# EAGLE design vera-module (EAGLE 7.7.0)

## Sheet 1 of 2
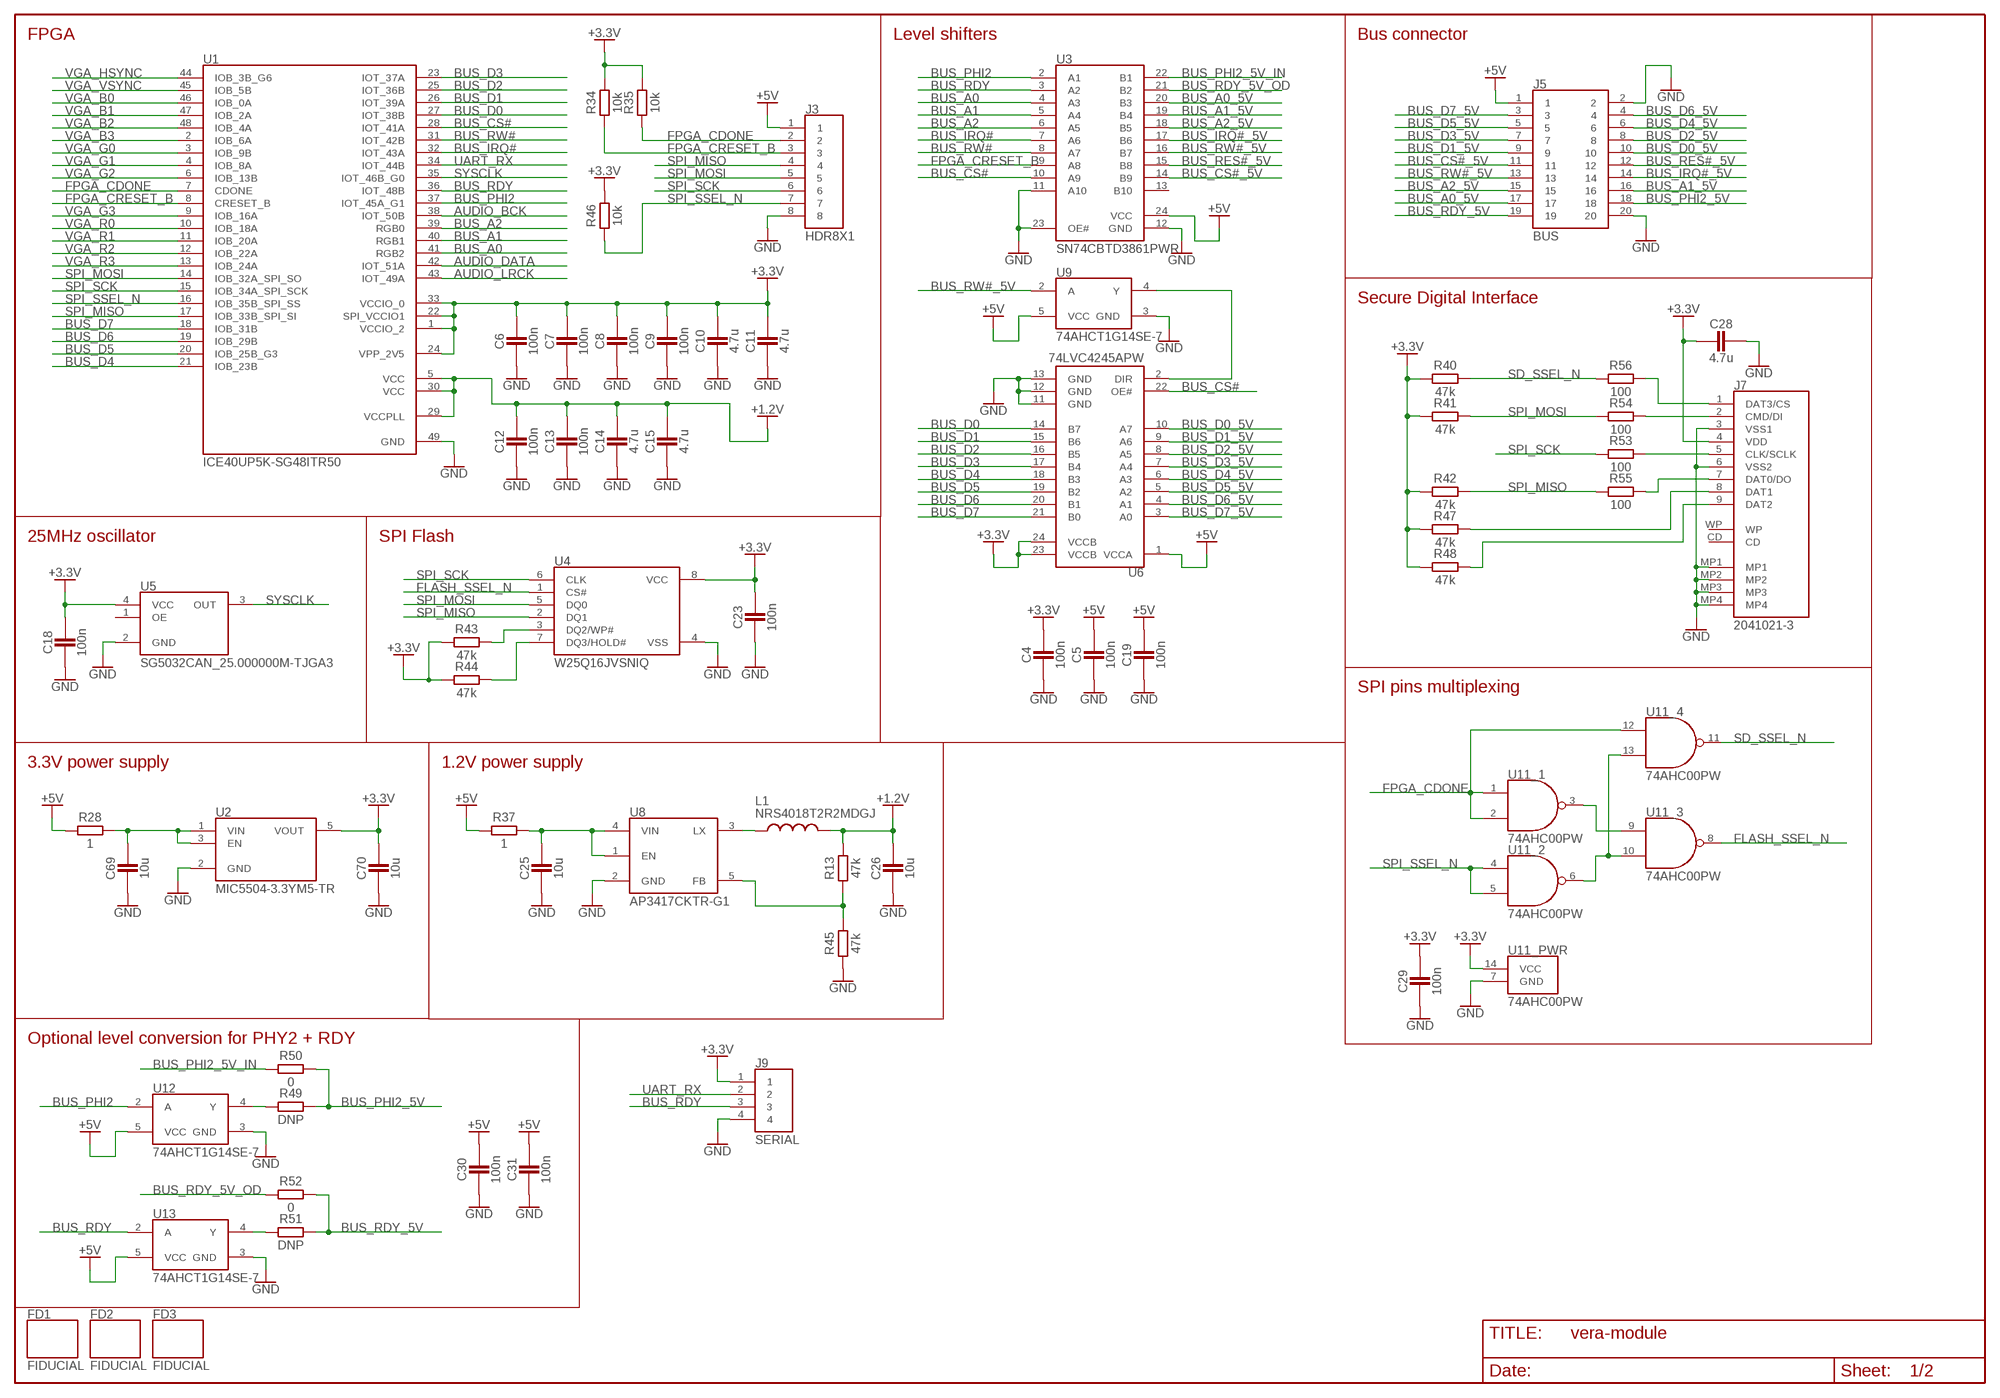
[diagram p0: schematic, sheet 1]

### Parts
C4  100n  CAPACITOR0603  [C0603]
C5  100n  CAPACITOR0603  [C0603]
C6  100n  CAPACITOR0603  [C0603]
C7  100n  CAPACITOR0603  [C0603]
C8  100n  CAPACITOR0603  [C0603]
C9  100n  CAPACITOR0603  [C0603]
C10  4.7u  CAPACITOR0603  [C0603]
C11  4.7u  CAPACITOR0603  [C0603]
C12  100n  CAPACITOR0603  [C0603]
C13  100n  CAPACITOR0603  [C0603]
C14  4.7u  CAPACITOR0603  [C0603]
C15  4.7u  CAPACITOR0603  [C0603]
C18  100n  CAPACITOR0603  [C0603]
C19  100n  CAPACITOR0603  [C0603]
C23  100n  CAPACITOR0603  [C0603]
C25  10u  CAPACITOR0805  [C0805]
C26  10u  CAPACITOR0805  [C0805]
C28  4.7u  CAPACITOR0603  [C0603]
C29  100n  CAPACITOR0603  [C0603]
C30  100n  CAPACITOR0603  [C0603]
C31  100n  CAPACITOR0603  [C0603]
C69  10u  CAPACITOR0805  [C0805]
C70  10u  CAPACITOR0805  [C0805]
FD1  FIDUCIAL  [FIDUCIAL]
FD2  FIDUCIAL  [FIDUCIAL]
FD3  FIDUCIAL  [FIDUCIAL]
J3  HDR8X1  [HDR8X1]
J5  BUS  HDR2X10  [HDR2X10]
J7  2041021-3  [2041021-3]
J9  SERIAL  HDR4X1  [HDR4X1]
L1  NRS4018T2R2MDGJ  INDUCTORNRS4018  [NRS4018]
R13  47k  RESISTOR0603  [R0603]
R28  1  RESISTOR0603  [R0603]
R34  10k  RESISTOR0603  [R0603]
R35  10k  RESISTOR0603  [R0603]
R37  1  RESISTOR0603  [R0603]
R40  47k  RESISTOR0603  [R0603]
R41  47k  RESISTOR0603  [R0603]
R42  47k  RESISTOR0603  [R0603]
R43  47k  RESISTOR0603  [R0603]
R44  47k  RESISTOR0603  [R0603]
R45  47k  RESISTOR0603  [R0603]
R46  10k  RESISTOR0603  [R0603]
R47  47k  RESISTOR0603  [R0603]
R48  47k  RESISTOR0603  [R0603]
R49  DNP  RESISTOR0603  [R0603]
R50  0  RESISTOR0603  [R0603]
R51  DNP  RESISTOR0603  [R0603]
R52  0  RESISTOR0603  [R0603]
R53  100  RESISTOR0603  [R0603]
R54  100  RESISTOR0603  [R0603]
R55  100  RESISTOR0603  [R0603]
R56  100  RESISTOR0603  [R0603]
U1  ICE40UP5K-SG48ITR50  [QFN-48]
U2  MIC5504-3.3YM5-TR  [SOT-23-5]
U3  SN74CBTD3861PWR  [TSSOP-24]
U4  W25Q16JVSNIQ  QSPI_FLASHSOIC8  [SOIC-8]
U5  SG5032CAN_25.000000M-TJGA3  SG5032CAN_40.000000M-TJGA3  [SG5032]
U6  74LVC4245APW  [TSSOP-24]
U8  AP3417CKTR-G1  [SOT-23-5]
U9  74AHCT1G14SE-7  [TSSOP-5]
U11  74AHC00PW  [TSSOP-14]
U12  74AHCT1G14SE-7  [TSSOP-5]
U13  74AHCT1G14SE-7  [TSSOP-5]

### Nets
+1.2V: C12.2 C13.2 C14.2 C15.2 C26.2 L1.2 R13.2 U1.5(VCC) U1.29(VCCPLL) U1.30(VCC)
+3.3V: C4.2 C6.2 C7.2 C8.2 C9.2 C10.2 C11.2 C18.2 C23.2 C28.1 C29.2 C70.2 J7.4(VDD) J9.1 R34.1 R35.1 R40.1 R41.1 R42.1 R43.1 R44.1 R46.1 R47.1 R48.1 U1.1(VCCIO_2) U1.22(SPI_VCCIO1) U1.24(VPP_2V5) U1.33(VCCIO_0) U2.5(VOUT) U4.8(VCC) U5.4(VCC) U6.23(VCCB) U6.24(VCCB) U11.14(_PWR:VCC) ; also sheet 2
+5V [5V]: C5.2 C19.2 C30.2 C31.2 J3.1 J5.1 R28.1 R37.1 U3.24(VCC) U6.1(VCCA) U9.5(VCC) U12.5(VCC) U13.5(VCC)
AUDIO_BCK: U1.38(IOT_50B) ; also sheet 2
AUDIO_DATA: U1.42(IOT_51A) ; also sheet 2
AUDIO_LRCK: U1.43(IOT_49A) ; also sheet 2
BUS_A0: U1.41(RGB2) U3.4(A3)
BUS_A0_5V: J5.17 U3.20(B3)
BUS_A1: U1.40(RGB1) U3.5(A4)
BUS_A1_5V: J5.16 U3.19(B4)
BUS_A2: U1.39(RGB0) U3.6(A5)
BUS_A2_5V: J5.15 U3.18(B5)
BUS_CS#: U1.28(IOT_41A) U3.10(A9) U6.22(OE#)
BUS_CS#_5V: J5.11 U3.14(B9)
BUS_D0: U1.27(IOT_38B) U6.14(B7)
BUS_D0_5V: J5.10 U6.10(A7)
BUS_D1: U1.26(IOT_39A) U6.15(B6)
BUS_D1_5V: J5.9 U6.9(A6)
BUS_D2: U1.25(IOT_36B) U6.16(B5)
BUS_D2_5V: J5.8 U6.8(A5)
BUS_D3: U1.23(IOT_37A) U6.17(B4)
BUS_D3_5V: J5.7 U6.7(A4)
BUS_D4: U1.21(IOB_23B) U6.18(B3)
BUS_D4_5V: J5.6 U6.6(A3)
BUS_D5: U1.20(IOB_25B_G3) U6.19(B2)
BUS_D5_5V: J5.5 U6.5(A2)
BUS_D6: U1.19(IOB_29B) U6.20(B1)
BUS_D6_5V: J5.4 U6.4(A1)
BUS_D7: U1.18(IOB_31B) U6.21(B0)
BUS_D7_5V: J5.3 U6.3(A0)
BUS_IRQ#: U1.32(IOT_43A) U3.7(A6)
BUS_IRQ#_5V: J5.14 U3.17(B6)
BUS_PHI2: U1.37(IOT_45A_G1) U3.2(A1) U12.2(A)
BUS_PHI2_5V: J5.18 R49.2 R50.2
BUS_PHI2_5V_IN: R50.1 U3.22(B1)
BUS_RDY: J9.3 U1.36(IOT_48B) U3.3(A2) U13.2(A)
BUS_RDY_5V: J5.19 R51.2 R52.2
BUS_RDY_5V_OD: R52.1 U3.21(B2)
BUS_RES#_5V: J5.12 U3.15(B8)
BUS_RW#: U1.31(IOT_42B) U3.8(A7)
BUS_RW#_5V: J5.13 U3.16(B7) U9.2(A)
FLASH_SSEL_N: U4.1(CS#) U11.8(_3:Y)
FPGA_CDONE: J3.2 R35.2 U1.7(CDONE) U11.1(_1:A) U11.2(_1:B) U11.12(_4:A)
FPGA_CRESET_B: J3.3 R34.2 U1.8(CRESET_B) U3.9(A8)
GND: C4.1 C5.1 C6.1 C7.1 C8.1 C9.1 C10.1 C11.1 C12.1 C13.1 C14.1 C15.1 C18.1 C19.1 C23.1 C25.1 C26.1 C28.2 C29.1 C30.1 C31.1 C69.1 C70.1 J3.8 J5.2 J5.20 J7.3(VSS1) J7.6(VSS2) J7.MP1 J7.MP2 J7.MP3 J7.MP4 J9.4 R45.1 U1.49(GND) U2.2(GND) U3.11(A10) U3.12(GND) U3.23(OE#) U4.4(VSS) U5.2(GND) U6.11(GND) U6.12(GND) U6.13(GND) U8.2(GND) U9.3(GND) U11.7(_PWR:GND) U12.3(GND) U13.3(GND) ; also sheet 2
N$7: C69.2 R28.2 U2.1(VIN) U2.3(EN)
N$8: U6.2(DIR) U9.4(Y)
N$14: R43.2 U4.3(DQ2/WP#)
N$15: R13.1 R45.2 U8.5(FB)
N$19: R44.2 U4.7(DQ3/HOLD#)
N$20: L1.1 U8.3(LX)
N$22 [5V]: C25.2 R37.2 U8.1(EN) U8.4(VIN)
N$43: J7.8(DAT1) R47.2
N$44: J7.9(DAT2) R48.2
N$46: U11.3(_1:Y) U11.9(_3:A)
N$47: U11.6(_2:Y) U11.10(_3:B) U11.13(_4:B)
N$48: R49.1 U12.4(Y)
N$50: R51.1 U13.4(Y)
N$51: J7.2(CMD/DI) R54.2
N$52: J7.5(CLK/SCLK) R53.2
N$53: J7.1(DAT3/CS) R56.2
N$54: J7.7(DAT0/DO) R55.2
SD_SSEL_N: R40.2 R56.1 U11.11(_4:Y)
SPI_MISO: J3.4 R42.2 R55.1 U1.17(IOB_33B_SPI_SI) U4.2(DQ1)
SPI_MOSI: J3.5 R41.2 R54.1 U1.14(IOB_32A_SPI_SO) U4.5(DQ0)
SPI_SCK: J3.6 R53.1 U1.15(IOB_34A_SPI_SCK) U4.6(CLK)
SPI_SSEL_N: J3.7 R46.2 U1.16(IOB_35B_SPI_SS) U11.4(_2:A) U11.5(_2:B)
SYSCLK: U1.35(IOT_46B_G0) U5.3(OUT) ; also sheet 2
UART_RX: J9.2 U1.34(IOT_44B)
VGA_B0: U1.46(IOB_0A) ; also sheet 2
VGA_B1: U1.47(IOB_2A) ; also sheet 2
VGA_B2: U1.48(IOB_4A) ; also sheet 2
VGA_B3: U1.2(IOB_6A) ; also sheet 2
VGA_G0: U1.3(IOB_9B) ; also sheet 2
VGA_G1: U1.4(IOB_8A) ; also sheet 2
VGA_G2: U1.6(IOB_13B) ; also sheet 2
VGA_G3: U1.9(IOB_16A) ; also sheet 2
VGA_HSYNC: U1.44(IOB_3B_G6) ; also sheet 2
VGA_R0: U1.10(IOB_18A) ; also sheet 2
VGA_R1: U1.11(IOB_20A) ; also sheet 2
VGA_R2: U1.12(IOB_22A) ; also sheet 2
VGA_R3: U1.13(IOB_24A) ; also sheet 2
VGA_VSYNC: U1.45(IOB_5B) ; also sheet 2
Unconnected: J7.CD J7.WP U3.13(B10) U5.1(OE)

### Notes on the sheet
- FPGA | Level shifters | Bus connector
- Secure Digital Interface
- 25MHz oscillator | SPI Flash
- SPI pins multiplexing
- 3.3V power supply | 1.2V power supply
- Optional level conversion for PHY2 + RDY

## Sheet 2 of 2
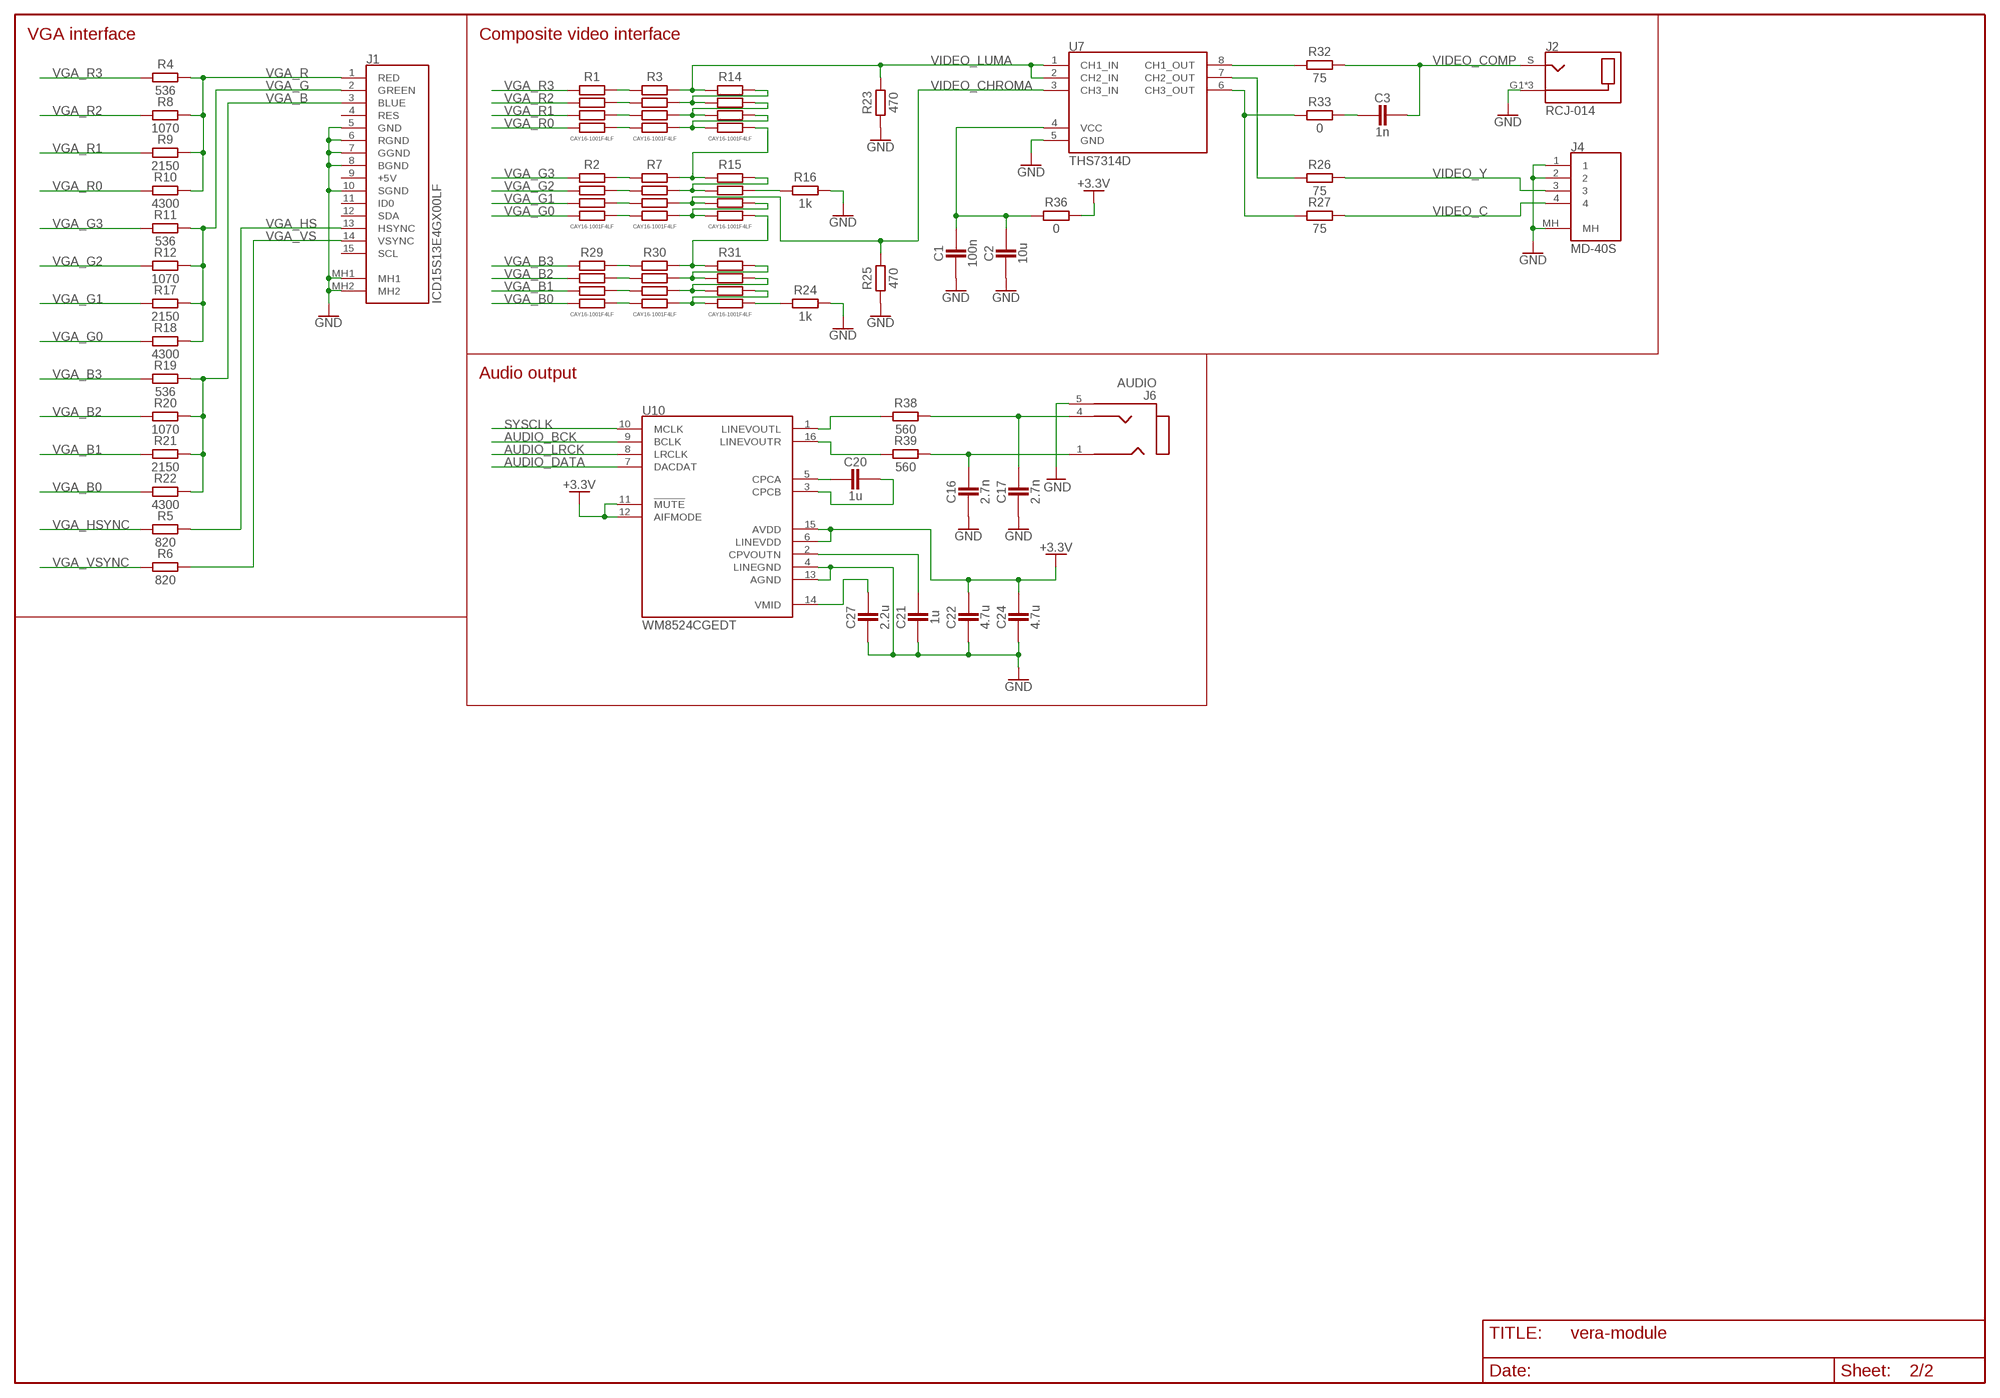
[diagram p1: schematic, sheet 2]

### Parts
C1  100n  CAPACITOR0603  [C0603]
C2  10u  CAPACITOR0805  [C0805]
C3  1n  CAPACITOR0603  [C0603]
C16  2.7n  CAPACITOR0603  [C0603]
C17  2.7n  CAPACITOR0603  [C0603]
C20  1u  CAPACITOR0603  [C0603]
C21  1u  CAPACITOR0603  [C0603]
C22  4.7u  CAPACITOR0603  [C0603]
C24  4.7u  CAPACITOR0603  [C0603]
C27  2.2u  CAPACITOR0603  [C0603]
J1  ICD15S13E4GX00LF  [1-1734344-2]
J2  RCJ-014  [RCJ-01X]
J4  MD-40S  [MD-40S]
J6  AUDIO  35RASMT2BHNTRX  [35RASMT2BHNTRX]
R1  CAY16-1001F4LF  RES_ARRAY41206  [RA4_1206]
R2  CAY16-1001F4LF  RES_ARRAY41206  [RA4_1206]
R3  CAY16-1001F4LF  RES_ARRAY41206  [RA4_1206]
R4  536  RESISTOR0603  [R0603]
R5  820  RESISTOR0603  [R0603]
R6  820  RESISTOR0603  [R0603]
R7  CAY16-1001F4LF  RES_ARRAY41206  [RA4_1206]
R8  1070  RESISTOR0603  [R0603]
R9  2150  RESISTOR0603  [R0603]
R10  4300  RESISTOR0603  [R0603]
R11  536  RESISTOR0603  [R0603]
R12  1070  RESISTOR0603  [R0603]
R14  CAY16-1001F4LF  RES_ARRAY41206  [RA4_1206]
R15  CAY16-1001F4LF  RES_ARRAY41206  [RA4_1206]
R16  1k  RESISTOR0603  [R0603]
R17  2150  RESISTOR0603  [R0603]
R18  4300  RESISTOR0603  [R0603]
R19  536  RESISTOR0603  [R0603]
R20  1070  RESISTOR0603  [R0603]
R21  2150  RESISTOR0603  [R0603]
R22  4300  RESISTOR0603  [R0603]
R23  470  RESISTOR0603  [R0603]
R24  1k  RESISTOR0603  [R0603]
R25  470  RESISTOR0603  [R0603]
R26  75  RESISTOR0603  [R0603]
R27  75  RESISTOR0603  [R0603]
R29  CAY16-1001F4LF  RES_ARRAY41206  [RA4_1206]
R30  CAY16-1001F4LF  RES_ARRAY41206  [RA4_1206]
R31  CAY16-1001F4LF  RES_ARRAY41206  [RA4_1206]
R32  75  RESISTOR0603  [R0603]
R33  0  RESISTOR0603  [R0603]
R36  0  RESISTOR0603  [R0603]
R38  560  RESISTOR0603  [R0603]
R39  560  RESISTOR0603  [R0603]
U7  THS7314D  [SOIC-8]
U10  WM8524CGEDT  [TSSOP-16]

### Nets
+3.3V: C22.2 C24.2 R36.2 U10.6(LINEVDD) U10.11(!MUTE) U10.12(AIFMODE) U10.15(AVDD) ; also sheet 1
AUDIO_BCK: U10.9(BCLK) ; also sheet 1
AUDIO_DATA: U10.7(DACDAT) ; also sheet 1
AUDIO_LRCK: U10.8(LRCLK) ; also sheet 1
GND: C1.1 C2.1 C16.1 C17.1 C21.1 C22.1 C24.1 C27.1 J1.5(GND) J1.6(RGND) J1.7(GGND) J1.8(BGND) J1.10(SGND) J1.MH1 J1.MH2 J2.G1(G) J2.G2(G) J2.G3(G) J4.1 J4.2 J4.MH J6.5(SLEEVE) R16.2 R23.1 R24.2 R25.1 U7.5(GND) U10.4(LINEGND) U10.13(AGND) ; also sheet 1
N$1: R1.1A R3.1B
N$2: R1.2A R3.2B
N$3: R1.3A R3.3B
N$4: R1.4A R3.4B
N$5: R2.1A R7.1B
N$6: R2.2A R7.2B
N$9: R29.1A R30.1B
N$10: R2.3A R7.3B
N$11: R2.4A R7.4B
N$12: R27.1 R33.1 U7.6(CH3_OUT)
N$13: R3.2A R14.1A R14.2B
N$16: R3.3A R14.2A R14.3B
N$17: R3.4A R14.3A R14.4B
N$18: R7.1A R14.4A R15.1B
N$21: R7.2A R15.1A R15.2B
N$23: R32.1 U7.8(CH1_OUT)
N$24: C3.1 R33.2
N$25: R7.4A R15.3A R15.4B
N$26: C20.2 U10.3(CPCB)
N$27: R29.2A R30.2B
N$28: R29.3A R30.3B
N$29: R15.2A R16.1
N$30: R29.4A R30.4B
N$31: R15.4A R30.1A R31.1B
N$32: R30.2A R31.1A R31.2B
N$33: R30.3A R31.2A R31.3B
N$34: R24.1 R31.4A
N$35: R30.4A R31.3A R31.4B
N$36: R26.1 U7.7(CH2_OUT)
N$37: C1.2 C2.2 R36.1 U7.4(VCC)
N$38: C17.2 J6.4(TIP) R38.2
N$39: C16.2 J6.1(RING) R39.2
N$40: R38.1 U10.1(LINEVOUTL)
N$41: R39.1 U10.16(LINEVOUTR)
N$42: C20.1 U10.5(CPCA)
N$45: C21.2 U10.2(CPVOUTN)
N$49: C27.2 U10.14(VMID)
SYSCLK: U10.10(MCLK) ; also sheet 1
VGA_B: J1.3(BLUE) R19.2 R20.2 R21.2 R22.2
VGA_B0: R22.1 R29.4B ; also sheet 1
VGA_B1: R21.1 R29.3B ; also sheet 1
VGA_B2: R20.1 R29.2B ; also sheet 1
VGA_B3: R19.1 R29.1B ; also sheet 1
VGA_G: J1.2(GREEN) R11.2 R12.2 R17.2 R18.2
VGA_G0: R2.4B R18.1 ; also sheet 1
VGA_G1: R2.3B R17.1 ; also sheet 1
VGA_G2: R2.2B R12.1 ; also sheet 1
VGA_G3: R2.1B R11.1 ; also sheet 1
VGA_HS: J1.13(HSYNC) R5.2
VGA_HSYNC: R5.1 ; also sheet 1
VGA_R: J1.1(RED) R4.2 R8.2 R9.2 R10.2
VGA_R0: R1.4B R10.1 ; also sheet 1
VGA_R1: R1.3B R9.1 ; also sheet 1
VGA_R2: R1.2B R8.1 ; also sheet 1
VGA_R3: R1.1B R4.1 ; also sheet 1
VGA_VS: J1.14(VSYNC) R6.2
VGA_VSYNC: R6.1 ; also sheet 1
VIDEO_C: J4.4 R27.2
VIDEO_CHROMA: R7.3A R15.3B R25.2 U7.3(CH3_IN)
VIDEO_COMP: C3.2 J2.S R32.2
VIDEO_LUMA: R3.1A R14.1B R23.2 U7.1(CH1_IN) U7.2(CH2_IN)
VIDEO_Y: J4.3 R26.2
Unconnected: J1.4(RES) J1.9(+5V) J1.11(ID0) J1.12(SDA) J1.15(SCL)

### Notes on the sheet
- VGA interface | Composite video interface
- Audio output

## Library data of the parts
C1-C31 C69 C70 = rcl:CAPACITOR
FD1-FD3 = misc:FIDUCIAL
J1 = connectors:ICD15S13E4GX00LF
J2 = connectors:RCJ-014
J3 = connectors:HDR8X1
J4 = connectors:MD-40S
J5 = connectors:HDR2X10
J6 = connectors:35RASMT2BHNTRX
J7 = connectors:2041021-3
J9 = connectors:HDR4X1
L1 = rcl:INDUCTOR
R1-R3 R7 R14 R15 R29-R31 = rcl:RES_ARRAY4
R4-R6 R8-R13 R16-R28 R32-R56 = rcl:RESISTOR
U1 = integrated_circuits:ICE40UP5K-SG48ITR50: Lattice ICE40 5K LE FPGA
U2 = integrated_circuits:MIC5504-3.3YM5-TR
U3 = integrated_circuits:SN74CBTD3861PWR
U4 = integrated_circuits:QSPI_FLASH
U5 = integrated_circuits:SG5032CAN_40.000000M-TJGA3: Epson 40 MHz 3.3V Oscillator +/- 50ppm
U6 = integrated_circuits:74LVC4245APW
U7 = integrated_circuits:THS7314D
U8 = integrated_circuits:AP3417CKTR-G1
U9 U12 U13 = integrated_circuits:74AHCT1G14SE-7
U10 = integrated_circuits:WM8524CGEDT
U11 = integrated_circuits:74AHC00PW

## Net classes
1 5V: clearance 0.2 mm

## Board
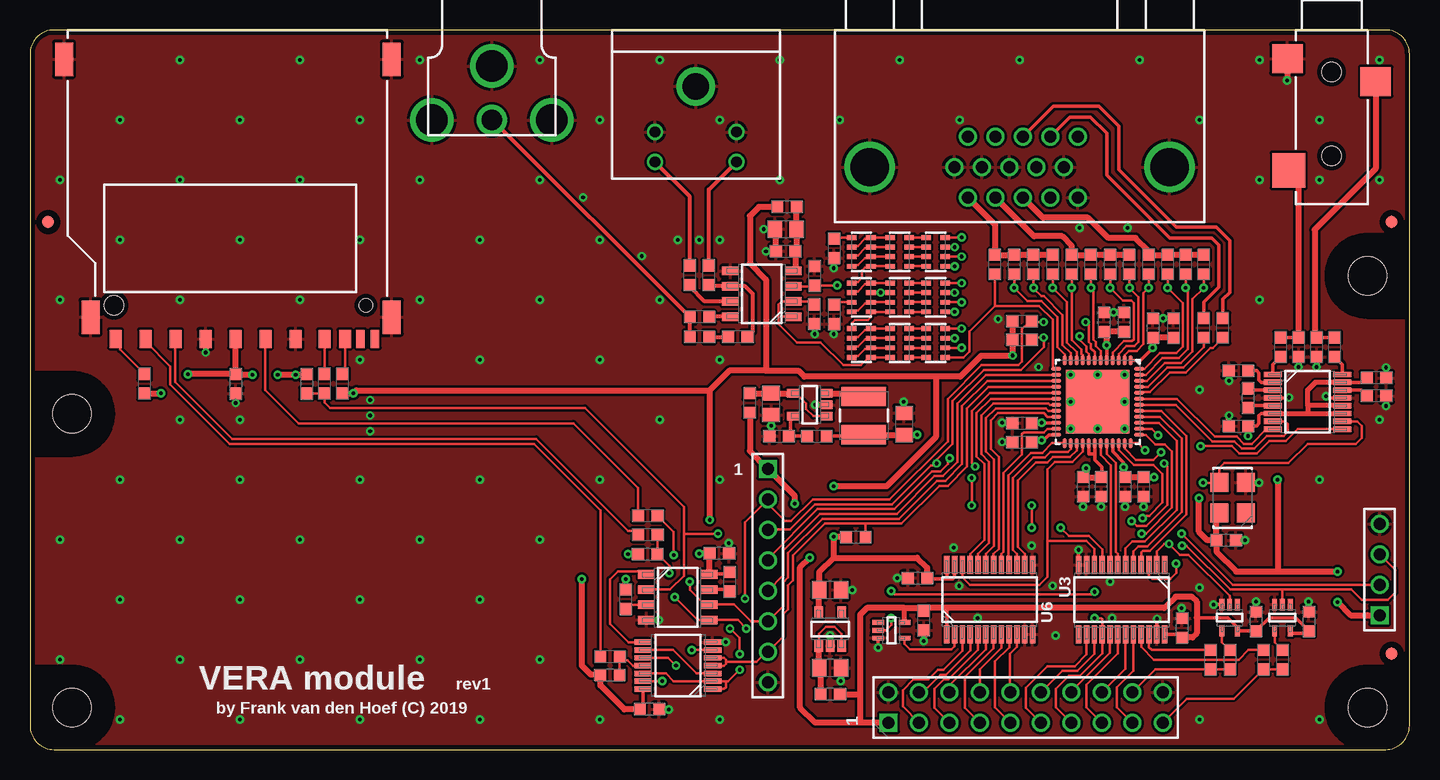
[diagram p2: board, top side]
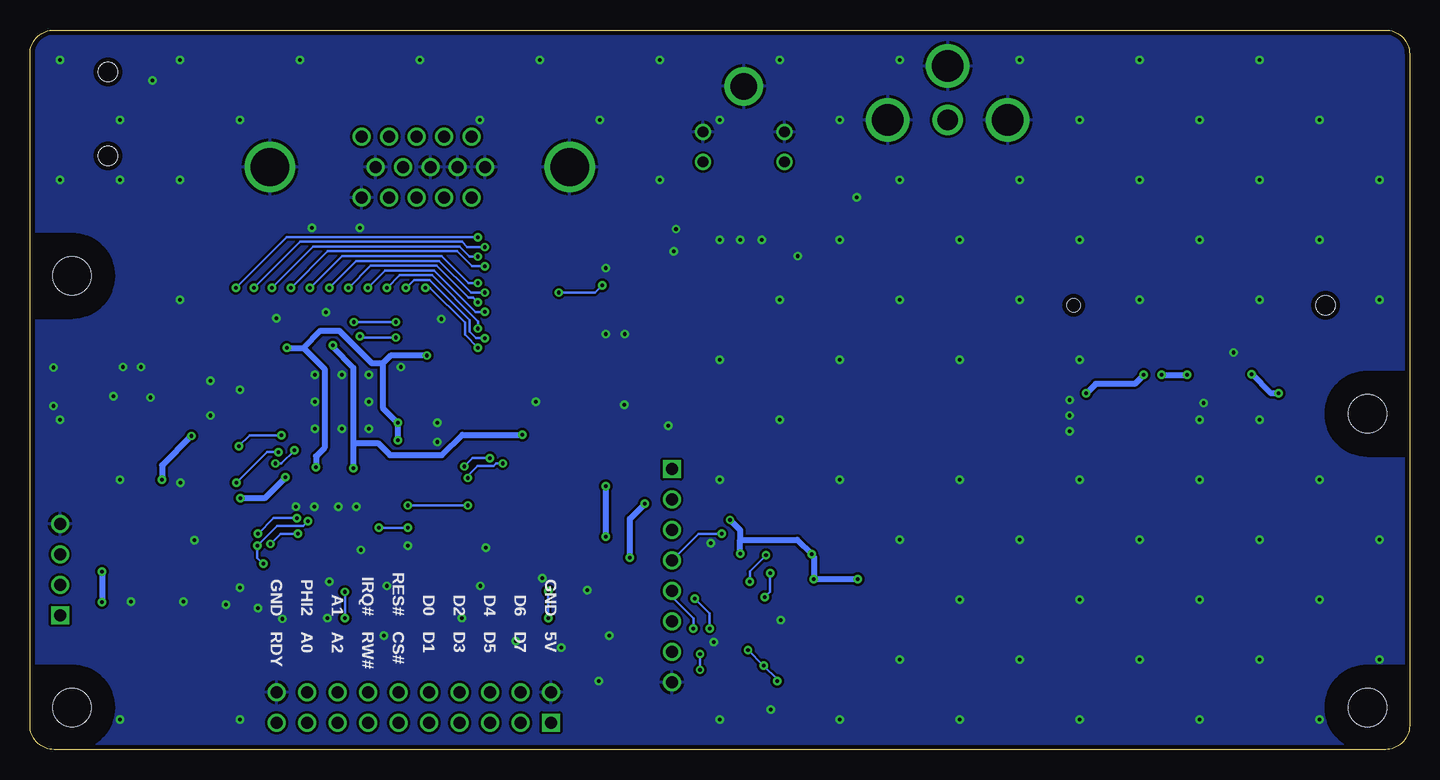
[diagram p3: board, bottom side, seen from below]

Size 115 x 60 mm. Coordinates in mm from the lower left corner, seen from the top.
Outline: 115,2 115,58 arc90 113,60 2,60 arc90 0,58 0,2 arc90 2,0 113,0 arc90 115,2
Copper layers (1*16): Top 0.035mm / dielectric 1.6mm / Bottom 0.035mm
Design rules "Frank_2-layer *": minimum track width 0.2mm, minimum drill 0.3mm, track to track 0.2mm, track to pad 0.2mm, pad to pad 0.2mm, via to via 0.2mm, smd to smd 0mil, copper to edge 0.4mm, drill to drill 10mil, minimum pad ring 0.2mm, minimum via ring 0.2mm, stop-mask expansion 0.1mm, vias tented up to drill 20mil, thermal gap 10mil
Holes 3.2 mm at 3.5,28 3.5,3.5 111.5,3.5 111.5,39.5
tRestrict: area 86,26 to 92,32; area 0,24.5 to 7,31.5; area 0,0 to 7,7; area 108,0 to 115,7; area 108,36 to 115,43
bRestrict: area 0,24.5 to 7,31.5; area 0,0 to 7,7; area 108,0 to 115,7; area 108,36 to 115,43

### Footprints (pad centres in the part's own frame; a part is rotated, then mirrored left to right if it is on the bottom)
C0603 = smd 0.95 x 1: 1 -0.8,0; 2 0.8,0
C0805 = smd 1.15 x 1.45: 1 -0.9,0; 2 0.9,0
FIDUCIAL = smd 1 x 1: FD 0,0
1-1734344-2 = drill 1: 1 4.315,13.97; 2 2.025,13.97; 3 -0.265,13.97; 4 -2.555,13.97; 5 -4.845,13.97; 6 5.455,11.43; 7 3.165,11.43; 8 0.875,11.43; 9 -1.415,11.43; 10 -3.705,11.43; 11 4.315,8.89; 12 2.025,8.89; 13 -0.265,8.89; 14 -2.555,8.89; 15 -4.845,8.89 | drill 3.18: MH1 -12.495,11.43; MH2 12.495,11.43
RCJ-01X = drill 2.6: G1 0,0; G2 -5,-4.5; G3 5,-4.5 | drill 1.7: S 0,-4.5
HDR8X1 = drill 1 square: 1 0,8.89 | drill 1: 2 0,6.35; 3 0,3.81; 4 0,1.27; 5 0,-1.27; 6 0,-3.81; 7 0,-6.35; 8 0,-8.89
MD-40S = drill 0.9: 1 -3.4,-8.5; 2 3.4,-8.5; 3 -3.4,-11; 4 3.4,-11 | drill 2.2: MH 0,-4.7
HDR2X10 = drill 1 square: 1 -1.27,11.43 | drill 1: 2 1.27,11.43; 3 -1.27,8.89; 4 1.27,8.89; 5 -1.27,6.35; 6 1.27,6.35; 7 -1.27,3.81; 8 1.27,3.81; 9 -1.27,1.27; 10 1.27,1.27; 11 -1.27,-1.27; 12 1.27,-1.27; 13 -1.27,-3.81; 14 1.27,-3.81; 15 -1.27,-6.35; 16 1.27,-6.35; 17 -1.27,-8.89; 18 1.27,-8.89; 19 -1.27,-11.43; 20 1.27,-11.43
35RASMT2BHNTRX = smd 2.4 x 2.55: 1 4.3,3.675; 5 2.4,-3.675 | smd 2.9 x 2.75: 4 11.7,-3.575 | hole 1.6: 3.5,0; 10.5,0
2041021-3 = smd 1 x 1.5: 1 6.875,25.75; 2 4.375,25.75; 3 1.875,25.75; 4 -0.625,25.75; 5 -3.125,25.75; 6 -5.625,25.75; 7 -8.055,25.75; 8 -9.755,25.75; 9 9.375,25.75 | smd 0.7 x 1.5: CD -11.055,25.75; WP -12.255,25.75 | smd 1.5 x 2.8: MP1 -13.65,23.95; MP2 11.45,23.95; MP3 -13.65,2.45; MP4 13.65,2.45 | hole 1.1: -11.5,22.95 | hole 1.6: 9.5,22.95
HDR4X1 = drill 1 square: 1 0,3.81 | drill 1: 2 0,1.27; 3 0,-1.27; 4 0,-3.81
NRS4018 = smd 1.6 x 3.7: 1 -1.6,0; 2 1.6,0
RA4_1206 = smd 0.4 x 0.8: 1A -1.2,0.8; 1B -1.2,-0.8; 2A -0.4,0.8; 2B -0.4,-0.8; 3A 0.4,0.8; 3B 0.4,-0.8; 4A 1.2,0.8; 4B 1.2,-0.8
R0603 = smd 0.95 x 1: 1 -0.8,0; 2 0.8,0
QFN-48 = smd 0.85 x 0.3: 1 -3.45,2.75; 2 -3.45,2.25; 3 -3.45,1.75; 4 -3.45,1.25; 5 -3.45,0.75; 6 -3.45,0.25; 7 -3.45,-0.25; 8 -3.45,-0.75; 9 -3.45,-1.25; 10 -3.45,-1.75; 11 -3.45,-2.25; 12 -3.45,-2.75; 25 3.45,-2.75; 26 3.45,-2.25; 27 3.45,-1.75; 28 3.45,-1.25; 29 3.45,-0.75; 30 3.45,-0.25; 31 3.45,0.25; 32 3.45,0.75; 33 3.45,1.25; 34 3.45,1.75; 35 3.45,2.25; 36 3.45,2.75 | smd 0.3 x 0.85: 13 -2.75,-3.45; 14 -2.25,-3.45; 15 -1.75,-3.45; 16 -1.25,-3.45; 17 -0.75,-3.45; 18 -0.25,-3.45; 19 0.25,-3.45; 20 0.75,-3.45; 21 1.25,-3.45; 22 1.75,-3.45; 23 2.25,-3.45; 24 2.75,-3.45; 37 2.75,3.45; 38 2.25,3.45; 39 1.75,3.45; 40 1.25,3.45; 41 0.75,3.45; 42 0.25,3.45; 43 -0.25,3.45; 44 -0.75,3.45; 45 -1.25,3.45; 46 -1.75,3.45; 47 -2.25,3.45; 48 -2.75,3.45 | smd 5.3 x 5.3: 49 0,0
SOT-23-5 = smd 1 x 0.71: 1 -1.4,0.95; 2 -1.4,0; 3 -1.4,-0.95; 4 1.4,-0.95; 5 1.4,0.95
TSSOP-24 = smd 1.5 x 0.45: 1 -2.9,3.575; 2 -2.9,2.925; 3 -2.9,2.275; 4 -2.9,1.625; 5 -2.9,0.975; 6 -2.9,0.325; 7 -2.9,-0.325; 8 -2.9,-0.975; 9 -2.9,-1.625; 10 -2.9,-2.275; 11 -2.9,-2.925; 12 -2.9,-3.575; 13 2.9,-3.575; 14 2.9,-2.925; 15 2.9,-2.275; 16 2.9,-1.625; 17 2.9,-0.975; 18 2.9,-0.325; 19 2.9,0.325; 20 2.9,0.975; 21 2.9,1.625; 22 2.9,2.275; 23 2.9,2.925; 24 2.9,3.575
SOIC-8 = smd 1.35 x 0.71: 1 -2.625,1.905; 2 -2.625,0.635; 3 -2.625,-0.635; 4 -2.625,-1.905; 5 2.625,-1.905; 6 2.625,-0.635; 7 2.625,0.635; 8 2.625,1.905
SG5032 = smd 1.6 x 1.5: 1 -1.27,-1.1; 2 1.27,-1.1; 3 1.27,1.1; 4 -1.27,1.1
TSSOP-5 = smd 0.95 x 0.4: 1 -1.1,0.65; 2 -1.1,0; 3 -1.1,-0.65; 4 1.1,-0.65; 5 1.1,0.65
TSSOP-16 = smd 1.5 x 0.45: 1 -2.9,2.275; 2 -2.9,1.625; 3 -2.9,0.975; 4 -2.9,0.325; 5 -2.9,-0.325; 6 -2.9,-0.975; 7 -2.9,-1.625; 8 -2.9,-2.275; 9 2.9,-2.275; 10 2.9,-1.625; 11 2.9,-0.975; 12 2.9,-0.325; 13 2.9,0.325; 14 2.9,0.975; 15 2.9,1.625; 16 2.9,2.275
TSSOP-14 = smd 1.45 x 0.45: 1 -2.9,1.95; 2 -2.9,1.3; 3 -2.9,0.65; 4 -2.9,0; 5 -2.9,-0.65; 6 -2.9,-1.3; 7 -2.9,-1.95; 8 2.9,-1.95; 9 2.9,-1.3; 10 2.9,-0.65; 11 2.9,0; 12 2.9,0.65; 13 2.9,1.3; 14 2.9,1.95

### Placement (x,y rotation side)
C1  63,41.55 0 top
C2  63,43.4 0 top
C3  55.8,34.4 180 top
C4  74,14.3 0 top
C5  96,10.15 270 top
C6  93.6,35.15 270 top
C7  82.7,27.25 0 top
C8  82.7,25.65 0 top
C9  91.3,21.9 90 top
C10  92.85,21.9 90 top
C11  95.3,35.15 270 top
C12  89.5,35.65 270 top
C13  89.3,21.9 90 top
C14  87.8,21.9 90 top
C15  91.2,35.65 270 top
C16  107.25,33.55 90 top
C17  105.75,33.55 90 top
C18  99.7,17.45 180 top
C19  74.5,10.75 90 top
C20  101.55,29.3 90 top
C21  100.75,31.6 0 top
C22  100.75,27 0 top
C23  57.45,16.35 180 top
C24  112.25,31 180 top
C25  61.8,28.8 90 top
C26  72.85,27.15 270 top
C27  112.25,29.5 180 top
C28  17.15,30.5 270 top
C29  51.65,3.35 180 top
C30  102.2,10.7 270 top
C31  106.6,10.7 270 top
C69  66.7,6.8 180 top
C70  66.7,13.3 180 top
FD1  1.5,44 0 top
FD2  113.5,8 0 top
FD3  113.5,44 0 top
J1  82.5,60 180 top
J2  38.5,57 0 top
J3  61.5,14.5 0 top
J4  55.5,60 0 top
J5  83,3.5 90 top
J6  108.5,60 270 top
J7  16.5,60 180 top
J9  112.5,15 180 top
L1  69.5,27.85 270 top
R1  75.5,33.9 90 top
R2  75.5,37.7 90 top
R3  72.5,33.9 90 top
R4  80.45,40.45 90 top
R5  99.45,35.15 90 top
R6  97.85,35.15 90 top
R7  72.5,37.7 90 top
R8  82.05,40.45 90 top
R9  83.65,40.45 90 top
R10  85.25,40.45 90 top
R11  86.85,40.45 90 top
R12  88.45,40.45 90 top
R13  65.6,26.15 0 top
R14  69.3,33.9 90 top
R15  69.3,37.7 90 top
R16  67,36.3 270 top
R17  90.05,40.45 90 top
R18  91.65,40.45 90 top
R19  93.25,40.45 90 top
R20  94.85,40.45 90 top
R21  96.35,40.45 90 top
R22  97.85,40.45 90 top
R23  65.4,36.3 90 top
R24  67,41.8 270 top
R25  65.4,39.5 270 top
R26  55,39.55 90 top
R27  56.6,39.55 90 top
R28  66.7,4.6 180 top
R29  75.5,41.5 90 top
R30  72.5,41.5 90 top
R31  69.3,41.5 90 top
R32  55.8,36.05 180 top
R33  59,34.4 180 top
R34  82.7,34.2 0 top
R35  82.7,35.75 0 top
R36  63.1,45.25 180 top
R37  60,28.9 90 top
R38  104.25,33.55 90 top
R39  108.75,33.55 90 top
R40  48.35,6.25 0 top
R41  51.5,16.3 0 top
R42  23.05,30.5 270 top
R43  49.65,12.55 270 top
R44  58.3,14 270 top
R45  62.45,26.15 0 top
R46  68.85,17.75 0 top
R47  26.05,30.5 90 top
R48  9.55,30.5 90 top
R49  100,7.5 270 top
R50  98.4,7.5 270 top
R51  104.4,7.5 270 top
R52  102.8,7.5 270 top
R53  51.5,19.5 180 top
R54  51.5,17.9 180 top
R55  24.55,30.5 90 top
R56  48.35,7.75 180 top
U1  89,29 270 top
U2  66.7,10.05 90 top
U3  91,12.5 270 top
U4  54,12.7 0 top
U5  100.25,21 90 top
U6  80,12.5 90 top
U7  61,38 180 top
U8  65,28.75 180 top
U9  71.8,9.95 0 top
U10  106.5,29 0 top
U11  54,7 180 top
U12  100,11 270 top
U13  104.4,11 270 top

### Tracks (layer width: path | path; a pad name or v marks a point on that pad's centre or on a via)
+1.2V  (via drill 0.3)
  Top 0.3: U1.5 v89.75,33.7 | U1.30 88.75,24.65 | 88.75,24.65 88.75,24.15 89.35,23.55 89.35,22.75 | R13.2 67.95,26.15 | U1.29 88.25,24.65 88.75,24.65
  Top 0.5: v89.75,33.7 89.75,34.6 C12.2 C15.2 | 89.35,22.75 C13.2 C14.2 88.05,22.95 v88.05,23.45 | 67.95,26.15 68.05,26.25 L1.2 C26.2 v73.95,26.25
  Bottom 0.5: v89.75,33.7 89.75,33.55 88.05,31.85 88.05,25.55 | 88.05,25.55 v88.05,23.45 | 88.05,25.55 86,25.55 85,24.55 80.65,24.55 78.95,26.25 v73.95,26.25
+3.3V  (via drill 0.3)
  Top 0.3: U1.22 v84.35,27.25 | U1.24 84.95,26.25 84.5,25.8 v84.35,25.8 | U1.33 90.25,24.85 91.15,23.95 v91.15,23.55 | U1.1 92.55,32.45 v93.6,33.5 | 56.65,14.63 58.13,14.63 R44.1 | U6.23 77.08,14.38 76.95,14.25 76.35,14.25 | U6.24 76.42,14.32 76.35,14.25 | 76.35,14.25 74.85,14.25 C4.2 | U10.6 102.62,28.02 102.45,27.85 102.45,27.2 102.25,27 C22.2 | U10.15 111.08,30.62 C24.2 | C29.2 51.1,3.6 U11.14
  Top 0.4: U10.15 107.12,30.62 106.5,30 106.5,28.7 | U10.6 106.5,28.02 | 106.5,28.02 U10.11 | U10.12 106.53,28.68 106.5,28.7 | 106.5,28.7 106.5,28.02
  Top 0.5: C7.2 v84.35,27.25 | C8.2 83.65,25.8 v84.35,25.8 | v91.15,23.55 91.15,22.85 C9.2 C10.2 v93.7,22.7 | C11.2 C6.2 v93.6,33.5 | U4.8 56.65,14.63 C23.2 v55.8,16.35 | 99.13,19.75 U5.4 98.9,19.48 C18.2 | R35.1 R34.1 v81.9,32.85 79.3,32.85 77.55,31.1 75.5,31.1 | U2.5 65.75,13.25 C70.2 65.8,14.8 67,16 | C18.2 98.15,17.45 97.45,18.15 v97.45,20.95 | C22.2 v101.55,26.15 | C28.1 17.15,34.23 J7.4 | C28.1 v13.15,31.3 | R48.1 v10.9,29.7 | R47.1 v26.95,29.7 27.2,29.95 56.65,29.95 | R42.1 23,31.25 v22.15,31.25 v20.65,31.25 | v18.55,31.25 17.2,31.25 C28.1 | R41.1 v49.85,16.3 | R43.1 v49.65,14.2 | C29.2 49.55,3.35 47.55,5.35 R40.1 46.75,6.25 46,7 v46,14.2 | 67,16 73.95,16 74.8,15.15 C4.2 | 67,16 v67,17.75 R46.1 | 75.5,31.1 64.55,31.1 64.05,31.6 61.35,31.6 | 75.5,31.1 75.5,26.05 71.4,21.95 v67,21.95 | R36.2 60.75,45.25 60,44.5 60,40.55 61.35,39.2 61.35,31.6 | 61.35,31.6 58.3,31.6 56.65,29.95 | 56.65,29.95 v56.65,19.15 | C18.2 98.9,16.5 100.55,14.85 104,14.85 | 104,14.85 v109,14.85 | v109,12.3 110.1,11.2 111.5,11.2 111.51,11.19 J9.1 | v104,22.5 104,14.85
  Bottom 0.5: v84.35,25.8 v84.35,27.25 85.6,28.5 85.6,32.2 | v93.6,33.5 92.2,33.5 | 92.2,33.5 90.45,31.75 90.45,25.15 91.15,24.45 v91.15,23.55 | v81.9,32.85 84.95,32.85 85.6,32.2 | 85.6,32.2 86.5,32.2 89.2,34.9 90.8,34.9 92.2,33.5 | v93.7,22.7 95.45,20.95 v97.45,20.95 | v10.9,29.7 11.55,29.7 v13.15,31.3 | v22.15,31.25 22.9,30.5 26.15,30.5 v26.95,29.7 | v20.65,31.25 v18.55,31.25 | v56.65,19.15 55.8,18.3 55.8,17.5 | v55.8,16.35 55.8,17.5 | 55.8,17.5 51.05,17.5 v49.85,16.3 49.65,16.1 v49.65,14.2 v46,14.2 | v67,17.75 v67,21.95 | v109,14.85 v109,12.3 | v101.55,26.15 104,23.7 v104,22.5
+5V  (via drill 0.3)
  Top 0.3: U3.24 95.75,9.6 C5.2 | U6.1 76.42,11.68 76.55,11.8 | U13.5 105.05,9.7 106.4,9.7 C31.2 105.5,11 103.3,11 C30.2 U12.5 100.65,10.2 99.85,11 97.25,11
  Top 0.4: U9.5 72.9,11.8
  Top 0.5: C5.2 96.9,9.35 97.25,9.7 97.25,11 97.25,12.35 96.85,12.75 95.5,12.75 94.55,11.8 76.55,11.8 74.75,11.8 C19.2 74.25,11.8 72.9,11.8 69.75,11.8 69.2,11.25 69.2,4.6 | R37.1 60,24.9 61.45,23.45 61.45,23.44 J3.1 63.75,21.14 v63.75,20.5 | R28.1 69.2,4.6 | J5.1 69.2,2.23 | 69.2,2.23 65.47,2.23 64.2,3.5 64.2,15.2 v65,16 | 69.2,4.6 69.2,2.23
  Bottom 0.5: v65,16 65,19.25 v63.75,20.5
AUDIO_BCK  (via drill 0.3)
  Top 0.2: U10.9 105.67,26.73 104.7,25.75 103.3,25.75 102.25,24.7 100.8,24.7 100.2,25.3 v97.6,25.3 | U1.38 93.5,26.75 v94.05,26.2
  Bottom 0.2: v94.05,26.2 96.7,26.2 v97.6,25.3
AUDIO_DATA
  Top 0.2: U10.7 104.62,27.38 104.85,27.15 104.85,26.5 104.5,26.15 103.1,26.15 102.05,25.1 101,25.1 100.4,25.7 98.55,25.7 95.5,28.75 U1.42
AUDIO_LRCK
  Top 0.2: U10.8 103.08,26.73 101.85,25.5 101.2,25.5 100.6,26.1 98.75,26.1 95.6,29.25 U1.43
BUS_A0
  Top 0.2: U1.41 94.3,28.25 96.4,26.15 96.4,19.6 93.35,16.55 92.75,16.55 92.62,16.43 U3.4
BUS_A0_5V
  Top 0.2: U3.20 91.97,6.58 90.6,5.2 90.6,3.52 J5.17
BUS_A1
  Top 0.2: U1.40 94.2,27.75 96,25.95 96,19.8 93.15,16.95 92.4,16.95 91.97,16.52 U3.5
BUS_A1_5V
  Top 0.2: U3.19 91.33,6.75 J5.16
BUS_A2
  Top 0.2: U1.39 94.1,27.25 95.6,25.75 95.6,20 92.95,17.35 91.9,17.35 91.33,16.77 U3.6
BUS_A2_5V
  Top 0.2: U3.18 90.67,8.03 88.05,5.4 88.05,3.53 J5.15
BUS_CS#
  Top 0.2: U1.28 87.75,24.85 86.9,24 85.45,24 84.8,23.35 84.8,17.4 | 84.8,17.4 88.05,17.4 88.72,16.73 U3.10 | U6.22 77.72,14.38 78.35,13.75 84.15,13.75 84.8,14.4 84.8,17.4
BUS_CS#_5V
  Top 0.2: J5.11 83,3.5 83,5.15 84.8,6.95 87.1,6.95 88.08,7.92 U3.14
BUS_D0
  Top 0.2: U1.27 87.25,24.95 86.7,24.4 85.25,24.4 84.8,23.95 83.85,23.95 82.35,22.45 82.35,16.9 82.92,16.32 U6.14
BUS_D0_5V
  Top 0.2: U6.10 82.28,8.57 81.7,8 81.7,4.8 J5.10
BUS_D1
  Top 0.2: U1.26 86.75,25.05 86.5,24.8 85.05,24.8 84.6,24.35 83.64,24.35 81.95,22.66 81.95,16.65 82.28,16.32 U6.15
BUS_D1_5V
  Top 0.2: J5.9 80.45,3.51 80.45,7.35 81.62,8.53 U6.9
BUS_D2
  Top 0.2: U1.25 85.2,25.55 84.4,24.75 83.45,24.75 81.55,22.85 81.55,15.47 U6.16
BUS_D2_5V
  Top 0.2: U6.8 80.97,8.47 79.2,6.7 J5.8
BUS_D3
  Top 0.2: U1.23 84.8,26.75 84.5,26.45 82.85,26.45 82.7,26.3 82.7,24.6 81.15,23.05 81.15,16.5 80.97,16.32 U6.17
BUS_D3_5V
  Top 0.2: U6.7 80.33,8.43 77.95,6.05 77.95,3.47 J5.7 79.19,2.06
BUS_D4
  Top 0.2: U1.21 84.8,27.75 84.5,28.05 80.7,28.05 80.1,27.45 80.1,25.05 80.75,24.4 80.75,16.75 80.33,16.32 U6.18
BUS_D4_5V
  Top 0.2: J5.6 76.65,5.35 79.67,8.38 U6.6
BUS_D5
  Top 0.2: U1.20 84.9,28.25 84.7,28.45 80.5,28.45 79.7,27.65 79.7,24.85 80.35,24.2 80.35,17 79.67,16.32 U6.19
BUS_D5_5V
  Top 0.2: J5.5 75.4,3.48 75.4,5.05 76.2,5.85 76.55,5.85 79.03,8.32 U6.5
BUS_D6
  Top 0.2: U1.19 85,28.75 84.9,28.85 80.3,28.85 79.3,27.85 79.3,24.65 79.95,24 79.95,17.25 79.03,16.32 U6.20
BUS_D6_5V
  Top 0.2: J5.4 74.42,4.77 75.9,6.25 76.35,6.25 78.38,8.28 U6.4
BUS_D7
  Top 0.2: U1.18 80.1,29.25 78.9,28.05 78.9,24.45 79.55,23.8 79.55,17.5 78.38,16.32 U6.21
BUS_D7_5V
  Top 0.2: J5.3 72.75,3.59 72.75,4.95 73.65,5.85 74.9,5.85 75.7,6.65 76.15,6.65 77.72,8.22 U6.3
BUS_IRQ#
  Top 0.2: U1.32 89.75,24.65 90.5,23.9 90.5,16.5 90.67,16.32 U3.7
BUS_IRQ#_5V
  Top 0.2: U3.17 90.03,8.07 86.81,4.86 J5.14
BUS_PHI2  (via drill 0.3)
  Top 0.2: U1.37 93,26.25 93.8,25.45 94.6,25.45 95.2,24.85 95.2,20.2 93,18 v92.65,18 | U3.2 93.92,16.52 94.55,17.15 v94.95,17.15 95.85,16.25 96.55,16.25 100,12.8 U12.2
  Bottom 0.2: v92.65,18 94.1,18 v94.95,17.15
BUS_PHI2_5V
  Top 0.2: R49.2 R50.2 93.82,6.7 J5.18
BUS_PHI2_5V_IN
  Top 0.2: R50.1 93.5,8.3 93.28,8.53 U3.22
BUS_RDY  (via drill 0.3)
  Top 0.2: U1.36 92.35,25.55 v92.95,24.95 | v94.55,23.85 94.8,23.6 94.8,20.4 93.05,18.65 92.25,18.65 v91.85,19.05 | v96.05,17 96.4,17 100.05,13.35 104.4,13.35 | 104.4,13.35 110.15,13.35 111,12.5 113.2,12.5 113.8,13.1 113.8,14.97 J9.3 | U3.3 93.28,14.53 93.55,14.25 95.05,14.25 95.55,14.75 v95.55,15.5 | U13.2 104.4,13.35
  Bottom 0.2: v92.95,24.95 94.05,23.85 v94.55,23.85 | v91.85,19.05 92.25,18.65 94.4,18.65 v96.05,17 96.05,16 v95.55,15.5
BUS_RDY_5V
  Top 0.2: R51.2 R52.2 100.35,4.25 96.45,4.25 J5.19
BUS_RDY_5V_OD
  Top 0.2: R52.1 101.55,8.3 100.75,7.5 93.7,7.5 92.62,8.57 U3.21
BUS_RES#_5V
  Top 0.2: U3.15 88.72,7.97 87.3,6.55 86.05,6.55 J5.12
BUS_RW#
  Top 0.2: U1.31 89.25,24.55 90.1,23.7 90.1,16.05 90.05,16 90.05,15.43 U3.8
BUS_RW#_5V  (via drill 0.3)
  Top 0.2: U9.2 71.35,9.95 71.8,10.4 v71.8,10.95 | v71.8,13.2 72.05,12.95 88.55,12.95 v88.75,13.15 | v88.75,10.95 89.3,10.95 89.38,10.88 U3.16 89.38,8.03 87.5,6.15 86.6,6.15 85.5,5.05 85.5,3.54 J5.13
  Bottom 0.2: v88.75,10.95 v88.75,13.15 | v71.8,10.95 v71.8,13.2
FLASH_SSEL_N
  Top 0.2: 51.35,14.63 U4.1 51.35,14.6 51.1,14.85 49,14.85 48.35,14.2 48.35,10.5 49.9,8.95 U11.8
FPGA_CDONE  (via drill 0.3)
  Top 0.2: U1.7 88.75,33.15 88.45,33.45 88.45,33.8 88.25,34 88.25,35.4 v88,35.65 | v84.5,35.65 83.6,35.65 R35.2 83.4,35.75 82.7,35.05 82.7,32.35 82.4,32.05 79.3,32.05 76.5,29.25 76.5,25.7 71.65,20.85 65.25,20.85 63.45,19.05 62.95,19.05 61.5,20.5 J3.2 59.6,18.95 v59.6,12.6 | U11.1 57.85,5.05 58,5.2 58,5.7 | 58,5.7 58.2,5.7 v59.15,6.65 | 58,5.7 U11.2 53.65,5.7 53,6.35 U11.12 | v58.35,10.1 59.15,9.3 v59.15,7.95
  Bottom 0.2: v88,35.65 v84.5,35.65 | v59.6,12.6 58.35,11.35 v58.35,10.1 | v59.15,7.95 v59.15,6.65
FPGA_CRESET_B  (via drill 0.3)
  Top 0.2: U1.8 88.25,33 88.05,33.2 88.05,33.6 87.5,34.15 v87.5,34.45 | R34.2 83.65,34.35 v84.5,34.35 84.5,33.55 82.6,31.65 79.5,31.65 76.9,29.05 76.9,25.5 75.6,24.2 v75.6,23.85 75.45,23.7 75.1,23.7 71.85,20.45 65.45,20.45 63.35,18.35 61.5,18.35 J3.3 | U3.9 89.38,16.68 88.25,17.8 86.6,17.8 v85.9,18.5 | v83.5,18.5 v83.5,20.35 | v78.5,22.65 v78.5,20.35
  Bottom 0.2: v87.5,34.45 87.4,34.35 v84.5,34.35 | v85.9,18.5 v83.5,18.5 | v83.5,20.35 v78.5,20.35 | v75.6,23.85 76.15,23.85 76.35,23.65 77.7,23.65 78.5,22.85 v78.5,22.65
GND  (via drill 0.3)
  Top 0.2: U3.12 87.4,15.43
  Top 0.3: U3.23 93.92,10.88 v93.95,10.9 | 87.4,15.43 v87.4,16.65 | U9.3 v70.7,8.5 | U10.4 104.92,29.32 v104.95,29.35 | U10.13 108.17,29.32 v108.05,29.45 | U11.7 v58,8.95 | U12.3 v98.65,12.1
  Top 0.5: C70.1 v68.55,13.3 | U8.2 v65.45,28.75 | C25.1 v61.8,27 61.8,26.3 R45.1 | C26.1 v72.85,29 | C7.1 v81.05,27.25 | C8.1 v81.05,25.65 | C13.1 v89.3,20.25 | C9.1 v91.3,20.25 | C10.1 v92.85,20.25 | C11.1 v94.45,35.95 C6.1 | C14.1 v87.8,20.25 | C23.1 v58.25,17.2 | U4.4 v52.4,10.8 | v86.75,31.25 v89,31.25 | v89,31.25 v91.25,31.25 v91.25,29 v91.25,26.75 v89,26.75 | v89,26.75 v86.75,26.75 | U1.49 v86.75,29 | U1.49 v89,31.25 | v89,26.75 U1.49 | U5.2 101.37,22.25 v102.45,22.25 | C5.1 v96,11.8 | C18.1 v101.3,17.45 | 67.9,6.7 67.8,6.8 C69.1 v67.6,5.7 | C19.1 v74.5,9.05 74.55,9 | C4.1 72.35,14.3 | U2.2 v66.7,9.5 | C17.1 v105.75,31.9 | C16.1 v107.25,31.9 | J7.3 14.65,34.25 v14.65,33.1 | C28.2 v17.15,28.9 | R24.2 v67,40.15 | R16.2 v67,34.65 | R23.1 v65.4,34.65 | v61.15,43.4 C2.1 62.15,43.35 62.15,41.55 | C1.1 62.15,41.55 | 62.15,41.55 v61.35,41.55 | C29.1 v53.25,3.35 | C24.1 v113.05,31.85 | C27.1 v113.05,28.65 | C30.1 v102.2,12.35 | C31.1 v106.6,12.35 | C21.1 v99.95,30.75 | C22.1 v99.95,27.85 | J6.5 104.8,57.58 v104.8,55.8
  Top 0.6: C12.1 v90.35,36.45 C15.1
  other vias: 72.3,14.3 77.45,13.65 85.25,13.65 79,10.95 90.05,14 97.5,13.5 90.2,10.95 83.5,17 77,16.85 80.7,35.9 84.1,31.9 87.5,43.5 91.5,43.5 85.5,9.5 112.5,47.5 28.35,29.15 7.5,2.5 2.5,7.5 7.5,12.5 2.5,17.5 7.5,22.5 12.5,17.5 12.5,7.5 17.5,2.5 17.5,12.5 17.5,22.5 27.5,22.5 37.5,22.5 42.5,17.5 32.5,17.5 22.5,17.5 27.5,12.5 37.5,12.5 42.5,7.5 32.5,7.5 22.5,7.5 27.5,2.5 37.5,2.5 47.5,2.5 2.5,37.5 2.5,47.5 7.5,52.5 17.5,52.5 17.5,42.5 12.5,37.5 12.5,47.5 7.5,42.5 12.5,57.5 22.5,57.5 27.5,52.5 22.5,47.5 27.5,42.5 22.5,37.5 12.5,27.5 17.5,27.5 32.5,47.5 37.5,42.5 32.5,37.5 37.5,32.5 27.5,32.5 47.5,32.5 57.5,32.5 42.5,37.5 52.5,27.5 57.5,2.5 47.5,22.5 52.5,37.5 47.5,42.5 42.5,47.5 47.5,52.5 42.5,57.5 32.5,57.5 52.5,57.5 62.5,57.5 57.5,52.5 62.5,47.5 57.5,42.5 57.5,22.5 67.5,52.5 72.5,57.5 82.5,57.5 92.5,57.5 102.5,57.5 97.5,52.5 77.5,52.5 102.5,47.5 102.5,37.5 107.5,52.5 107.5,47.5 112.5,57.5 107.5,2.5 97.5,2.5 107.5,22.5 112.5,27.5 97.5,30 28.35,27.85 28.35,26.55 54,42.5 55.8,42.5 46.1,46.05 51,41.15
  pour Bottom: 2,60 113,60 arc-90 115,58 115,2 arc-90 113,0 2,0 arc-90 0,2 0,58 arc-90
  pour Top: 2,60 113,60 arc-90 115,58 115,2 arc-90 113,0 2,0 arc-90 0,2 0,58 arc-90
N$1
  Top 0.2: R3.1B R1.1A
N$2
  Top 0.2: R3.2B R1.2A
N$3
  Top 0.2: R3.3B R1.3A
N$4
  Top 0.2: R3.4B R1.4A
N$5
  Top 0.2: R7.1B R2.1A
N$6
  Top 0.2: R7.2B R2.2A
N$7
  Top 0.2: U2.1 65.75,9.65 66.35,10.25 67.05,10.25 67.65,9.65 U2.3
  Top 0.5: C69.2 65.75,6.8 | 65.75,6.8 U2.1 | 65.75,6.8 65.9,6.65 R28.2
N$8
  Top 0.2: U6.2 77.08,8.62 76.8,8.35 73.35,8.35 72.9,8.8 U9.4
N$9
  Top 0.2: R30.1B R29.1A
N$10
  Top 0.2: R7.3B R2.3A
N$11
  Top 0.2: R7.4B R2.4A
N$12
  Top 0.35: R27.1 56.72,38.63 U7.6 59.62,38.63 60.25,38 60.25,34.85 R33.1
N$13
  Top 0.2: R3.2A R14.2B 70,33.4 69.6,33.4 69,32.8 68.6,32.8 R14.1A
N$14
  Top 0.2: U4.3 49.97,12.06 R43.2
N$15
  Top 0.3: R13.1 R45.2 63.4,26.3 63.4,27.8 U8.5
N$16
  Top 0.2: R3.3A R14.3B 70,34.2 69.6,34.2 69,33.6 68.6,33.6 R14.2A
N$17
  Top 0.2: R3.4A R14.4B 70,35 69.6,35 69,34.4 68.6,34.4 R14.3A
N$18
  Top 0.2: R7.1A R15.1B 70.1,36.05 69.85,35.8 68.75,35.8 68.5,35.55 R14.4A
N$19
  Top 0.3: U4.7 58.16,13.34 R44.2
N$20
  Top 0.5: U8.3 69.5,29.7 L1.1
N$21
  Top 0.2: R7.2A R15.2B 70,37.2 69.6,37.2 69,36.6 68.6,36.6 R15.1A
N$22
  Top 0.2: U8.1 65.3,27.8 64.7,28.4 64.7,28.85 63.85,29.7 U8.4
  Top 0.5: U8.4 C25.2 R37.2
N$23
  Top 0.35: U7.8 56.65,36.09 R32.1
N$24
  Top 0.35: C3.1 R33.2
N$25
  Top 0.2: R7.4A R15.4B 70,38.8 69.6,38.8 69,38.2 68.6,38.2 R15.3A
N$26
  Top 0.3: U10.3 101.67,29.98 C20.2
N$27
  Top 0.2: R30.2B R29.2A
N$28
  Top 0.2: R30.3B R29.3A
N$29
  Top 0.2: R15.2A 67.2,37.3 R16.1
N$30
  Top 0.2: R30.4B R29.4A
N$31
  Top 0.2: R30.1A R31.1B 70,40.2 69.6,40.2 69.35,39.95 69.35,39.35 69,39 68.6,39 R15.4A
N$32
  Top 0.2: R30.2A R31.2B 70,41 69.6,41 69,40.4 68.6,40.4 R31.1A
N$33
  Top 0.2: R30.3A R31.3B 70,41.8 69.6,41.8 69,41.2 68.6,41.2 R31.2A
N$34
  Top 0.2: R31.4A 67.1,42.7 R24.1
N$35
  Top 0.2: R30.4A R31.4B 70,42.6 69.6,42.6 69,42 68.6,42 R31.3A
N$36
  Top 0.35: U7.7 56.23,37.37 55,38.6 R26.1
N$37
  Top 0.5: R36.1 C2.2 63.9,41.65 C1.2 63.8,40.08 U7.4
N$38
  Top 0.3: R38.2 C17.2
  Top 0.5: C17.2 105.75,47.48 J6.4
N$39
  Top 0.3: R39.2 C16.2
  Top 0.5: J6.1 112.17,48.42 107.1,43.35 107.1,34.5 C16.2
N$40
  Top 0.3: U10.1 103.6,32.1 R38.1
N$41
  Top 0.3: U10.16 109.4,32.1 R39.1
N$42
  Top 0.3: U10.5 101.72,28.68 C20.1
N$43
  Top 0.2: R47.2 26.25,31.5 J7.8
N$44
  Top 0.2: R48.2 7.5,33.35 7.5,33.6 7.12,33.98 J7.9
N$45
  Top 0.3: U10.2 102.62,30.62 102.45,30.8 102.45,31.4 102.25,31.6 C21.2
N$46
  Top 0.2: U11.3 55.55,6.35 53.6,8.3 U11.9
N$47  (via drill 0.3)
  Top 0.2: U11.6 v55.15,8.3 | v53.85,7 53.2,7.65 U11.10 | U11.13 v52.7,5.7
  Bottom 0.2: v55.15,8.3 v53.85,7 52.7,5.85 v52.7,5.7
N$48
  Top 0.2: R49.1 99.35,8.95 U12.4
N$49
  Top 0.3: U10.14 110.97,29.98 C27.2
N$50
  Top 0.2: U13.4 103.75,8.95 R51.1
N$51
  Top 0.2: J7.2 12.1,34.23 12.1,30.65 16.85,25.9 42.2,25.9 49.85,18.25 50.35,18.25 R54.2
N$52
  Top 0.2: J7.5 19.6,34.23 19.6,30 22.4,27.2 45.3,27.2 50.7,21.8 R53.2
N$53
  Top 0.2: J7.1 9.62,34.02 11.7,31.95 11.7,30.45 16.65,25.5 42,25.5 47.55,19.95 R56.2
N$54
  Top 0.2: J7.7 R55.2
SD_SSEL_N
  Top 0.2: R40.2 R56.1 49.45,7.45 49.8,7.45 50.25,7 U11.11
SPI_MISO  (via drill 0.3)
  Top 0.2: 51.39,13.35 U4.2 53.34,13.34 54.5,14.5 54.5,18 | U1.17 80,29.75 78.5,28.25 78.5,23.9 v78.8,23.6 | R42.2 R55.1 24.55,28.95 25,28.5 46.25,28.5 54.5,20.25 54.5,18 | v76.65,24.3 76.5,24.15 76.5,23.8 75.9,23.2 75.2,23.2 72.05,20.05 65.65,20.05 61.5,15.9 J3.4 | 54.5,18 v57.35,18
  Bottom 0.2: v76.65,24.3 78.1,24.3 v78.8,23.6 | v57.35,18 59.27,18 J3.4
SPI_MOSI  (via drill 0.3)
  Top 0.2: U4.5 | U1.14 79.7,31.25 77.3,28.85 77.3,24 76.1,22.8 75.4,22.8 72.25,19.65 65.85,19.65 62.8,16.6 62.8,14.55 61.5,13.25 J3.5 | U4.5 57,10.79 57,10.8 59,10.8 v59.7,10.1 | R54.1 R41.2 53.3,15.3 v53.3,14.7 | v53.75,12.7 55.65,10.8 U4.5
  Bottom 0.2: v53.3,14.7 53.3,13.15 v53.75,12.7 | v59.7,10.1 59.7,10.95 61.5,12.75 J3.5
SPI_SCK  (via drill 0.3)
  Top 0.2: 56.56,12 U4.6 | U1.15 79.8,30.75 77.7,28.65 77.7,23.8 76.3,22.4 75.6,22.4 72.45,19.25 66.05,19.25 63.2,16.4 63.2,14.35 62.8,13.95 62.8,12 J3.6 60.11,10.69 58.7,12.1 56.66,12.1 U4.6 | 56.64,12.05 U4.6 | U4.6 56.27,12.06 55,13.33 v55,14 | R53.1 53.65,18.15 v53.65,16.2
  Bottom 0.2: v53.65,16.2 55,14.85 v55,14
SPI_SSEL_N
  Top 0.2: U1.16 79.9,30.25 78.1,28.45 78.1,23.6 76.5,22 75.8,22 72.65,18.85 69.65,18.85 | U11.4 57.85,7 58,7.15 58,7.3 | 58,7.3 58,7.5 57.85,7.65 U11.5 | 69.65,18.85 66.25,18.85 63.6,16.2 63.6,14.1 63.2,13.7 63.2,11.7 62.8,11.3 62.8,9.45 J3.7 61.4,8.15 60.55,7.3 58,7.3 | R46.2 69.65,18.85
SYSCLK  (via drill 0.3)
  Top 0.2: U1.35 91.25,25.1 92.2,24.15 93.65,24.15 v94.3,24.8 | v97.8,22.25 99.13,22.25 U5.3 99.15,23.5 99.55,23.9 104.9,23.9 106.5,25.5 110.5,25.5 111,26 111,27 110.62,27.38 U10.10
  Bottom 0.2: v97.8,22.25 95.25,24.8 v94.3,24.8
UART_RX  (via drill 0.3)
  Top 0.2: U1.34 90.75,25 92,23.75 93.65,23.75 94.4,23 94.4,20.6 93.3,19.5 93.1,19.5 92.9,19.3 v92.75,19.3 | v96,18 100.25,13.75 112.48,13.75 J9.2
  Bottom 0.2: v92.75,19.3 94.7,19.3 v96,18
VGA_B
  Top 0.5: R22.2 R21.2 R20.2 R19.2 93.25,41.55 92.15,42.65 89.9,42.65 88.2,44.35 84.44,44.35 J1.3
VGA_B0  (via drill 0.3)
  Top 0.2: U1.46 93.1,30.75 94.6,32.25 95.95,32.25 96.9,33.2 96.9,37.55 v97.85,38.5 R22.1 | R29.4B v77.65,42.7
  Bottom 0.2: v97.85,38.5 93.6,42.75 77.7,42.75 v77.65,42.7
VGA_B1  (via drill 0.3)
  Top 0.2: U1.47 93,31.25 94.4,32.65 95.75,32.65 96.5,33.4 96.5,38.35 v96.35,38.5 R21.1 | R29.3B v77.1,41.9
  Bottom 0.2: v96.35,38.5 92.5,42.35 79,42.35 78.55,41.9 v77.1,41.9
VGA_B2  (via drill 0.3)
  Top 0.2: U1.48 92.9,31.75 94.2,33.05 95.55,33.05 96.1,33.6 96.1,37.25 v94.85,38.5 R20.1 | R29.2B v77.65,41.1
  Bottom 0.2: v94.85,38.5 91.4,41.95 79.2,41.95 78.35,41.1 v77.65,41.1
VGA_B3  (via drill 0.3)
  Top 0.2: U1.2 91.25,32.9 91.6,33.25 92.25,33.25 92.8,33.8 92.8,38.05 v93.25,38.5 R19.1 | R29.1B v77.1,40.3
  Bottom 0.2: v93.25,38.5 90.2,41.55 79.4,41.55 78.15,40.3 v77.1,40.3
VGA_G
  Top 0.5: R18.2 R17.2 R12.2 R11.2 86.85,42 86.05,42.8 83.7,42.8 J1.2
VGA_G0  (via drill 0.3)
  Top 0.2: U1.3 90.75,33 91.4,33.65 92.05,33.65 92.4,34 92.4,37.75 v91.65,38.5 R18.1 | R2.4B v77.65,38.9
  Bottom 0.2: v91.65,38.5 89,41.15 80.7,41.15 78.45,38.9 v77.65,38.9
VGA_G1  (via drill 0.3)
  Top 0.2: U1.4 90.25,33.1 91.2,34.05 91.85,34.05 92,34.2 92,37.25 91.8,37.45 91.1,37.45 v90.05,38.5 R17.1 | R2.3B v77.1,38.1
  Bottom 0.2: v90.05,38.5 87.8,40.75 80.9,40.75 78.25,38.1 v77.1,38.1
VGA_G2  (via drill 0.3)
  Top 0.2: U1.6 89.25,33.25 88.85,33.65 88.85,34 88.65,34.2 88.65,38.3 v88.45,38.5 R12.1 | R2.2B v77.65,37.3
  Bottom 0.2: v88.45,38.5 86.6,40.35 81.1,40.35 78.45,37.7 78.05,37.7 v77.65,37.3
VGA_G3  (via drill 0.3)
  Top 0.2: U1.9 87.75,32.9 87.65,33 87.65,33.35 86.85,34.15 v86.85,38.5 R11.1 | R2.1B v77.1,36.5
  Bottom 0.2: v86.85,38.5 85.4,39.95 81.3,39.95 77.85,36.5 v77.1,36.5
VGA_HS
  Top 0.3: R5.2 99.45,37.55 100,38.1 100,42.45 98.9,43.55 95.55,43.55 90.75,48.35 90.75,52 89.1,53.65 85.31,53.65 J1.13
VGA_HSYNC
  Top 0.2: U1.44 92.5,29.8 93.35,29.8 95,31.45 96.35,31.45 98.4,33.5 98.6,33.5 R5.1
VGA_R
  Top 0.5: R10.2 R9.2 R8.2 R4.2 80.45,43.77 J1.1
VGA_R0  (via drill 0.3)
  Top 0.2: U1.10 87.25,33.15 86.45,33.95 86.45,37.3 v85.25,38.5 R10.1 | R1.4B v77.65,35.1
  Bottom 0.2: v85.25,38.5 84.2,39.55 81.5,39.55 77.65,35.7 v77.65,35.1
VGA_R1  (via drill 0.3)
  Top 0.2: U1.11 86.75,33.05 86.05,33.75 86.05,36.25 84.5,37.8 84.3,37.8 83.65,38.45 v83.65,38.5 R9.1 | R1.3B v77.1,34.3
  Bottom 0.2: v83.65,38.5 83,39.15 81.7,39.15 78.35,35.8 78.35,34.85 77.8,34.3 v77.1,34.3
VGA_R2  (via drill 0.3)
  Top 0.2: U1.12 86.25,32.95 85.65,33.55 85.65,36.05 84.3,37.4 83.15,37.4 v82.05,38.5 R8.1 | R1.2B v77.65,33.5
  Bottom 0.2: v77.65,33.5 78.75,34.6 78.75,35.6 81.65,38.5 v82.05,38.5 81.7,38.5
VGA_R3
  Top 0.2: 80.45,39.7 R4.1 80.45,37 | U1.13 85.25,31.75 85.25,35.85 84.1,37 80.45,37 | R1.1B 77.8,32.7 78.3,33.2 78.3,34.85 80.45,37
VGA_VS
  Top 0.3: J1.14 86.69,52.75 88.4,52.75 89.75,51.4 89.75,47.9 95,42.65 98.5,42.65 99.1,42.05 99.1,38.55 97.85,37.3 R6.2
VGA_VSYNC
  Top 0.2: U1.45 93.2,30.25 94.8,31.85 96.15,31.85 97.85,33.55 R6.1
VIDEO_C
  Top 0.35: R27.2 56.6,46.7 J4.4
VIDEO_CHROMA  (via drill 0.3)
  Top 0.2: R15.3B v70.9,38.1 R7.3A | v67.3,38.7 R25.2 65.31,38.62 63.65,38.62 U7.3
  Bottom 0.2: v70.9,38.1 67.9,38.1 v67.3,38.7
VIDEO_COMP
  Top 0.35: C3.2 R32.2 38.55,52.5 J2.S
VIDEO_LUMA
  Top 0.2: R3.1A R14.1B 69.9,32.7 69.25,32.05 67.8,32.05 65.9,33.95 63.95,33.95 62.4,35.5 62.4,36.1 | R23.2 65.14,37.37 U7.2 62.66,37.37 62.4,37.1 62.4,36.1 | U7.1 62.41,36.09 62.4,36.1
VIDEO_Y
  Top 0.35: R26.2 55,46.1 J4.3

### Text on the board
tPlace: 1 | VERA module | rev1 | by Frank van den Hoef (C) 2019 | 1
bPlace: GND | D6 | D4 | D2 | D0 | RES# | IRQ# | A1 | PHI2 | GND | 5V | D7 | D5 | D3 | D1 | CS# | RW# | A2 | A0 | RDY